# Altium schematic sheet Sheet2.SchDoc
size A4; SheetNumber: 1; SheetTotal: 1
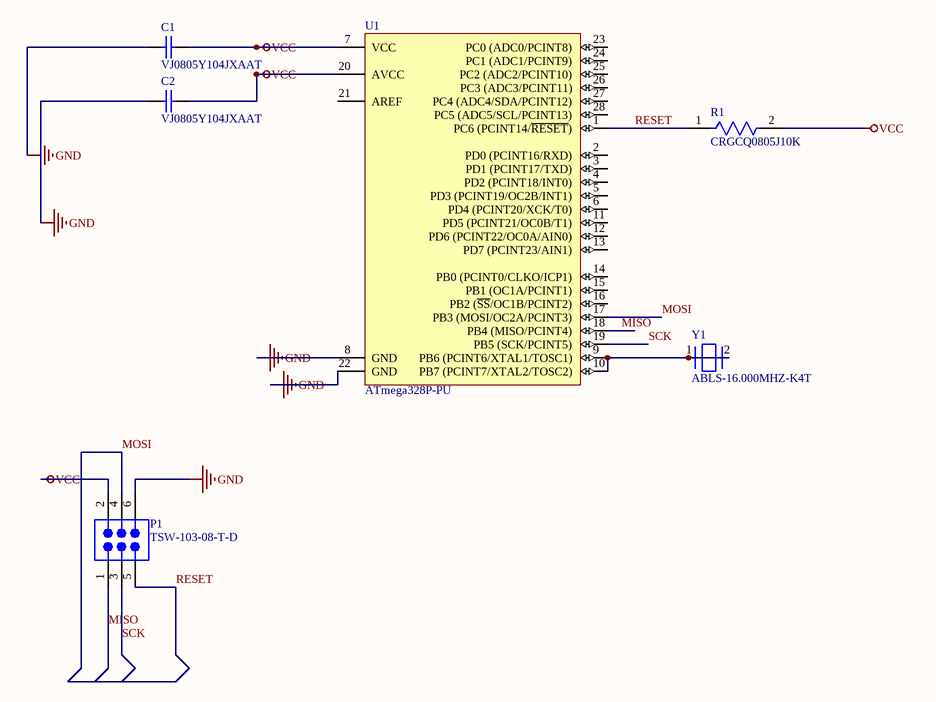
[diagram p0: Sheet2.SchDoc]

## Parts
C1  VJ0805Y104JXAAT  [CAPC2013X145X48ML20T23]
C2  VJ0805Y104JXAAT  [CAPC2013X145X48ML20T23]
P1  TSW-103-08-T-D  [SMTC-TSW-103-08-X-D]
R1  CRGCQ0805J10K  [FP-CRGCQ0805-IPC_C]
U1  ATmega328P-PU  [28P3]
Y1  ABLS-16.000MHZ-K4T  [FP-ABLS-MFG]

## Nets
GND: C1.1 C2.1 P1.6 U1.8(GND) U1.22(GND)
VCC: C1.2 C2.2 P1.2 R1.2 U1.7(VCC) U1.20(AVCC)
MISO: P1.1 U1.18(PB4_(MISO/PCINT4))
MOSI: P1.4 U1.17(PB3_(MOSI/OC2A/PCINT3))
RESET: P1.5 R1.1 U1.1(PC6_(PCINT14/~{RESET}))
SCK: P1.3 U1.19(PB5_(SCK/PCINT5))
NetU1_9: U1.9(PB6_(PCINT6/XTAL1/TOSC1)) U1.10(PB7_(PCINT7/XTAL2/TOSC2)) Y1.1 Y1.2

Not connected (* = marked no-connect by the designer): U1 2(PD0_(PCINT16/RXD)) 3(PD1_(PCINT17/TXD)) 4(PD2_(PCINT18/INT0)) 5(PD3_(PCINT19/OC2B/INT1)) 6(PD4_(PCINT20/XCK/T0)) 11(PD5_(PCINT21/OC0B/T1)) 12(PD6_(PCINT22/OC0A/AIN0)) 13(PD7_(PCINT23/AIN1)) 14(PB0_(PCINT0/CLKO/ICP1)) 15(PB1_(OC1A/PCINT1)) 16(PB2_(~{SS}/OC1B/PCINT2)) 21(AREF) 23(PC0_(ADC0/PCINT8)) 24(PC1_(ADC1/PCINT9)) 25(PC2_(ADC2/PCINT10)) 26(PC3_(ADC3/PCINT11)) 27(PC4_(ADC4/SDA/PCINT12)) 28(PC5_(ADC5/SCL/PCINT13))

## Library data of the parts
C1 C2 = CMP-2007-03164-1: Manufacturer: Vitramon; Part Number: VJ0805Y104JXAAT
P1 = CMP-1024-00335-1: 0.025" SQ Post Header, Through-hole, Vertical, -55 to 105 degC, 2.54 mm Pitch, 6-Pin, Male, RoHS; Manufacturer: Samtec; Pitch: 2.54 mm; PackageDescription: .025[0.64] SQ. Post Terminal Strip Assembly; DatasheetVersion: F-214; ComponentLink3Description: Package Specification; Mounting Technology: Through-hole; ComponentLink1URL: http://www.samtec.com; ComponentLink2URL: http://www.samtec.com/documents/webfiles/pdf/TSW_TH.PDF; PartNumber: TSW-103-08-T-D; ComponentLink1Description: Manufacturer URL; Temperature Range: -55 to 105 degC; ComponentLink2Description: Datasheet; PackageVersion: DM, 8/1988; RoHS: True; ComponentLink3URL: http://www.samtec.com/documents/webfiles/cpdf/TSW-XXX-XX-XXX-X-XX-XXX-MKT.pdf; Orientation: Vertical; PackageReference: TSW-103-08-X-D
R1 = CMP-03211-002989-1: CRGCQ 0805 10K 5%; Manufacturer: TE Connectivity; Voltage Rating: 150V; Temperature Coefficient: ±100ppm/°C; Resistance: 10KΩ; Description: CRGCQ0805 10KΩ 0.125W ±100ppm/°C 5% 150V; Value: 10KΩ; Power Rating: 0.125W; Tolerance: 0.05; Automotive Grade: Grade 914; Height: 0.65mm; Lead Free: Yes; Temperature Range High: +155°C; Composition: Thick Film; Temperature Range Low: -55°C; Ambient Temperature Range High: +70°C; Temperature: -55°C to +155°C; Package: CRGCQ0805; Device Class L2: Resistors; RoHS: TRUE; ComponentLink2URL: https://www.te.com/commerce/DocumentDelivery/DDEController?Action=showdoc&DocId=Data+Sheet%7F1773204-3%7F1%7Fpdf%7FEnglish%7FENG_DS_1773204-3_1.pdf%7F4-2176341-923; Manufacturer Part Number: CRGCQ0805J10K; Series: CRGCQ; Device Class L1: Passive Components; Ipc Land Pattern Name: RESC200125X55; ComponentLink2Description: Datasheet; Category: Res; Digikey Description: CRGCQ 0805 10K 5%; Mouser Description: Res Thick Film 0805 10K Ohm 5% 0.125W(1/8W) ±100ppm/C Pad SMD Automotive T/R; Automotive: Yes; Octopart: https://octopart.com/crgcq0805j10k-te+connectivity-91018201; Device Class L3: Chip SMD Resistors
U1 = CMP-0095-00013-2: 8-bit AVR Microcontroller, 32KB Flash, 1KB EEPROM, 2KB SRAM, 28-pin PDIP, Industrial Grade (-40°C to 85°C); RevisionNote: DatasheetVersion updated. URLs added.; PackageVersion: revB, Sep-2001; PackageDescription: 28-lead (0.300"/7.62mm Wide) Plastic Dual Inline Package (PDIP); DatasheetVersion: revD, May-2011; ComponentLink1Description: Manufacturer URL; ComponentLink1URL: http://www.atmel.com/; PackageReference: 28P3; ComponentLink2Description: ATmega48A/48PA/88A/88PA/168A/168PA/328/328P Datasheet; ComponentLink3URL: http://www.atmel.com/dyn/resources/prod_documents/8271S.pdf; ComponentLink2URL: http://www.atmel.com/dyn/resources/prod_documents/8271.pdf; ComponentLink3Description: ATmega48A/48PA/88A/88PA/168A/168PA/328/328P Summary
Y1 = CMP-27762-000003-1: CRYSTAL 16.0000MHZ 18PF SMD; Manufacturer: Abracon; Frequency: 16MHz; Stability: 50ppm; Tolerance: 30ppm; Description: 16MHz ±30ppm Crystal 18pF 40 Ohms HC-49/US; Standoff Height: 0mm; Esr: 40Ω; ComponentLink2URL: https://abracon.com/Resonators/abls.pdf; Temperature Range High: +125°C; Package: ABLS; Device Class L3: Crystals; Temperature: -40°C to +125°C; Load Capacitance: 18pF; Device Class L2: Crystals / Oscillators; Mouser Description: Crystal 16MHz ±30ppm (Tol) ±50ppm (Stability) 18pF FUND 40Ohm 2-Pin HC-49/US SMD T/R; Category: Crys; ComponentLink2Description: Datasheet; Manufacturer Part Number: ABLS-16.000MHZ-K4T; Series: ABLS; Automotive: No; Octopart: https://octopart.com/abls-16.000mhz-k4t-abracon-18618626; RoHS: TRUE; Digikey Description: CRYSTAL 16.0000MHZ 18PF SMD; Temperature Range Low: -40°C; Lead Free: Yes; Height: 4.3mm; Device Class L1: Passive Components